# Altium schematic sheet Forma de onda corriente.SchDoc
size A4
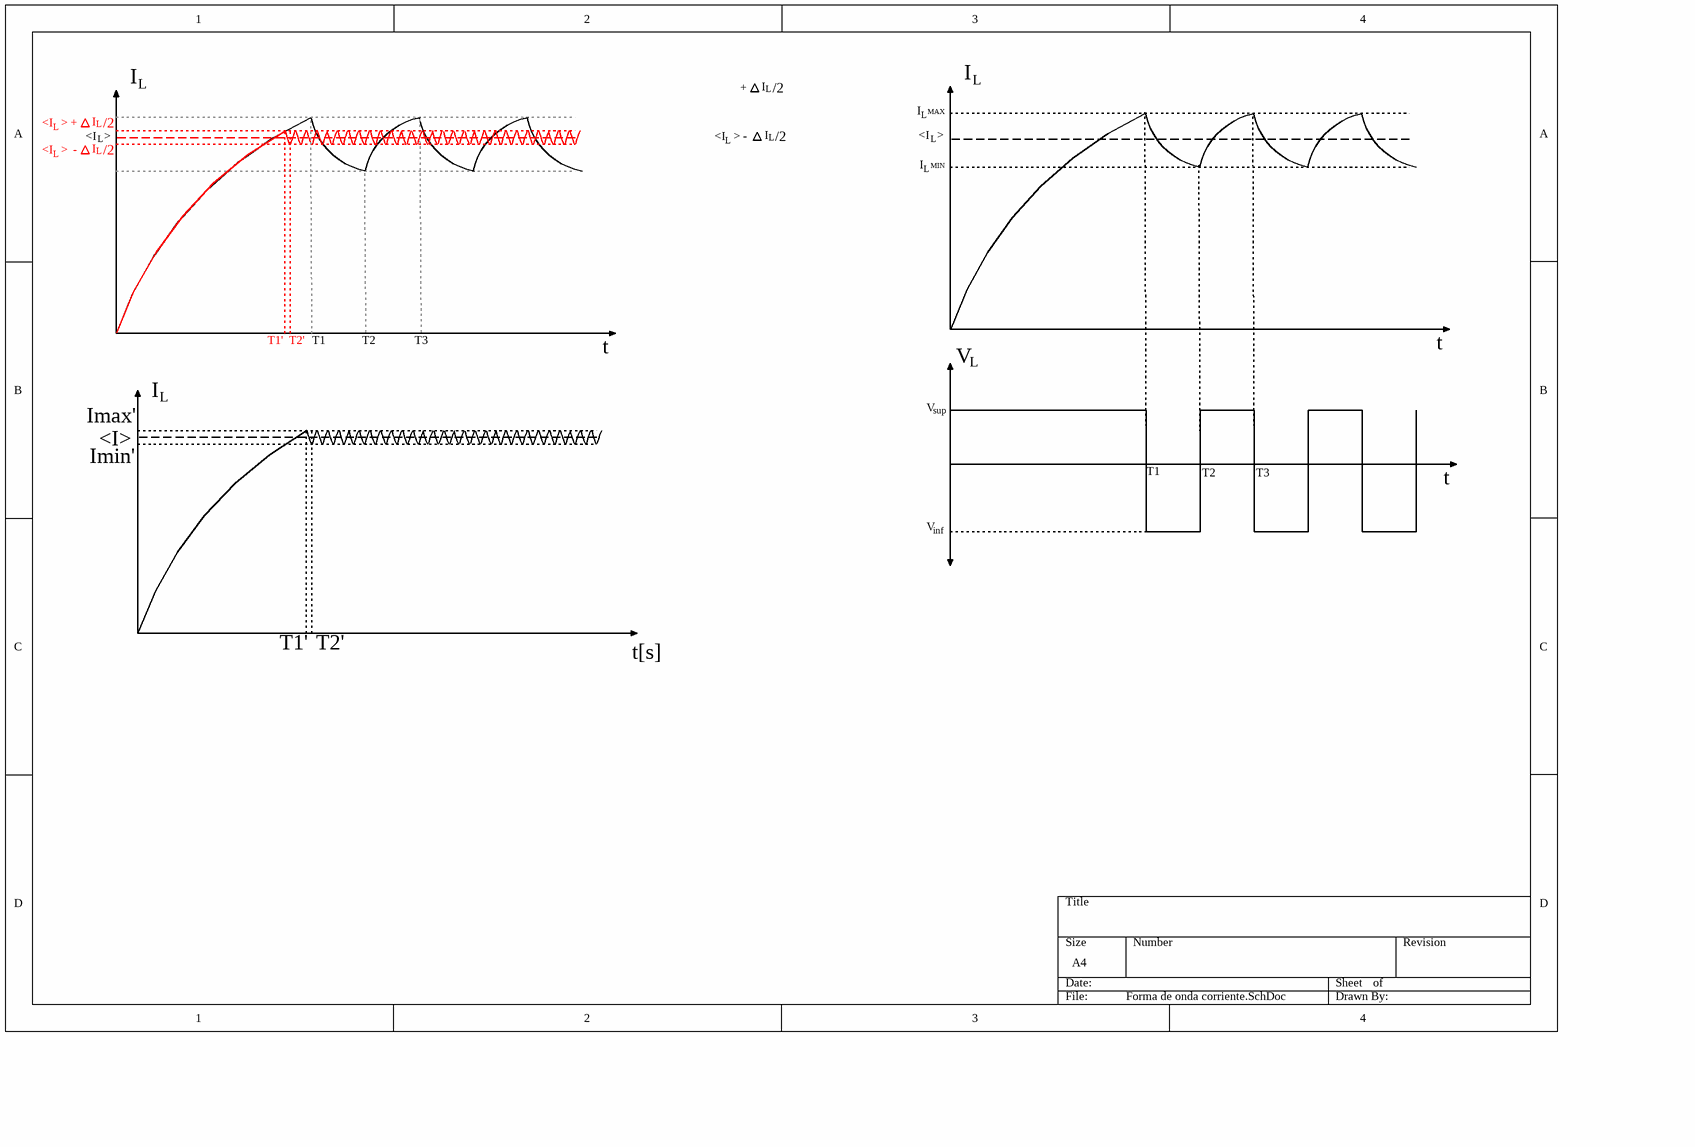
[diagram p0: Forma de onda corriente.SchDoc]

## Notes on the sheet
- I
- L
- +
- /2
- MAX
- <I
- >
- -
- MIN
- T1'
- T2'
- T1
- T2
- T3
- t
- V
- Imax'
- <I>
- sup
- Imin'
- inf
- t[s]